# Altium schematic sheet CapBank_Introspection.SchDoc
size A; SheetNumber: 3
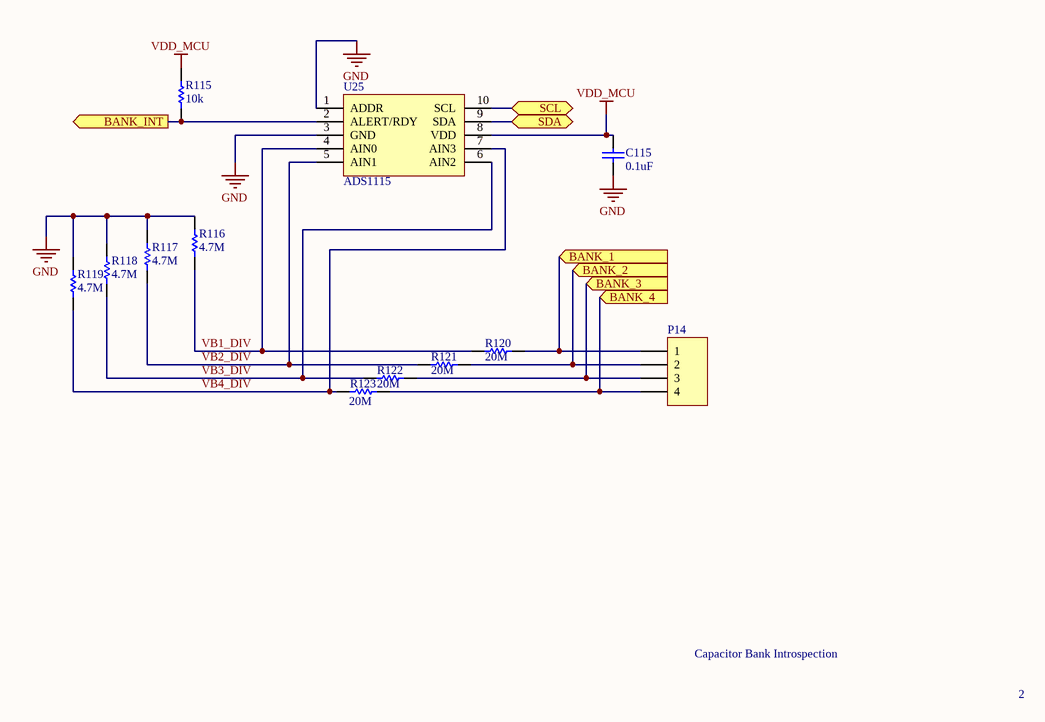
[diagram p0: CapBank_Introspection.SchDoc]

## Parts
C115  value 0.1uF  [0603]  (hidden comment: Cap)
P14  (no value)  [MHDR1X4]
R115  value 10k  [0603]  (hidden comment: Res)
R116  value 4.7M  [0603]  (hidden comment: Res)
R117  value 4.7M  [0603]  (hidden comment: Res)
R118  value 4.7M  [0603]  (hidden comment: Res)
R119  value 4.7M  [0603]  (hidden comment: Res)
R120  value 20M  [0603]  (hidden comment: Res)
R121  value 20M  [0603]  (hidden comment: Res)
R122  value 20M  [0603]  (hidden comment: Res)
R123  value 20M  [0603]  (hidden comment: Res)
U25  ADS1115  [VSSOP10]

## Ports
BANK_1 (in), BANK_2 (in), BANK_3 (in), BANK_4 (in), BANK_INT (out), SCL (bidir), SDA (bidir)

## Nets
GND: C115.1 R116.2 R117.2 R118.2 R119.2 U25.1(ADDR) U25.3(GND)
VDD_MCU: C115.2 R115.2 U25.8(VDD)
BANK_1: P14.1 R120.2 ; port BANK_1
BANK_2: P14.2 R121.2 ; port BANK_2
BANK_3: P14.3 R122.2 ; port BANK_3
BANK_4: P14.4 R123.2 ; port BANK_4
BANK_INT: R115.1 U25.2(ALERT/RDY) ; port BANK_INT
SCL: U25.10(SCL) ; port SCL
SDA: U25.9(SDA) ; port SDA
VB1_DIV: R116.1 R120.1 U25.4(AIN0)
VB2_DIV: R117.1 R121.1 U25.5(AIN1)
VB3_DIV: R118.1 R122.1 U25.6(AIN2)
VB4_DIV: R119.1 R123.1 U25.7(AIN3)

## Notes on the sheet
- Capacitor Bank Introspection
- 2

## Library data of the parts
C115 = Cap: Ceramic Capacitor (Surface Mount); Manufacturer: Murata Electronics North America; Manufacturer Part Number: GRM188R71C104KA01D; Digi-Key Part Number: *; Note: *; Rating: *; Distributor Part Number: 490-1532-1-ND; Distributor: Digi-Key
P14 = MHDR1X4: Header, 4-Pin; Manufacturer: Harwin Inc.; Manufacturer Part Number: M52-5000445; LatestRevisionDate: 17-Jul-2002; LatestRevisionNote: Re-released for DXP Platform.; Publisher: Altium Limited; Digi-Key Part Number: 952-3358-ND; Distributor: Mouser; Distributor Part Number: 855-M52-5000445; Mouser Part Number: 855-M52-5000445
R115 = Res: Chip Resistor (Surface Mount); Manufacturer: Yageo; Manufacturer Part Number: RC0603FR-0710KL; Digi-Key Part Number: *; Rating: *; Note: *; Distributor: Digi-Key; Distributor Part Number: 311-10.0KHRCT-ND
R116-R119 = Res: Chip Resistor (Surface Mount); Manufacturer: Generic Chip Res (TBD); Manufacturer Part Number: RC0603FR-074M7L; Digi-Key Part Number: *; Rating: *; Note: *; Distributor: Digi-Key; Distributor Part Number: 311-4.70MHRCT-ND
R120-R123 = Res: Chip Resistor (Surface Mount); Manufacturer: Vishay Dale; Manufacturer Part Number: CRCW060320M0JPEAHR; Digi-Key Part Number: *; Rating: *; Note: *; Distributor: Digi-Key; Distributor Part Number: 541-20MAHCT-ND
U25 = ADS1115: Manufacturer: Texas Instruments; Manufacturer Part Number: ADS1115IDGSR; Distributor: Digikey; Distributor Part Number: 296-38849-1-ND; Mouser Part Number: 595-ADS1115IDGSR; Digi-Key Part Number: 296-38849-1-ND